# Altium schematic sheet clock.SchDoc
size A4
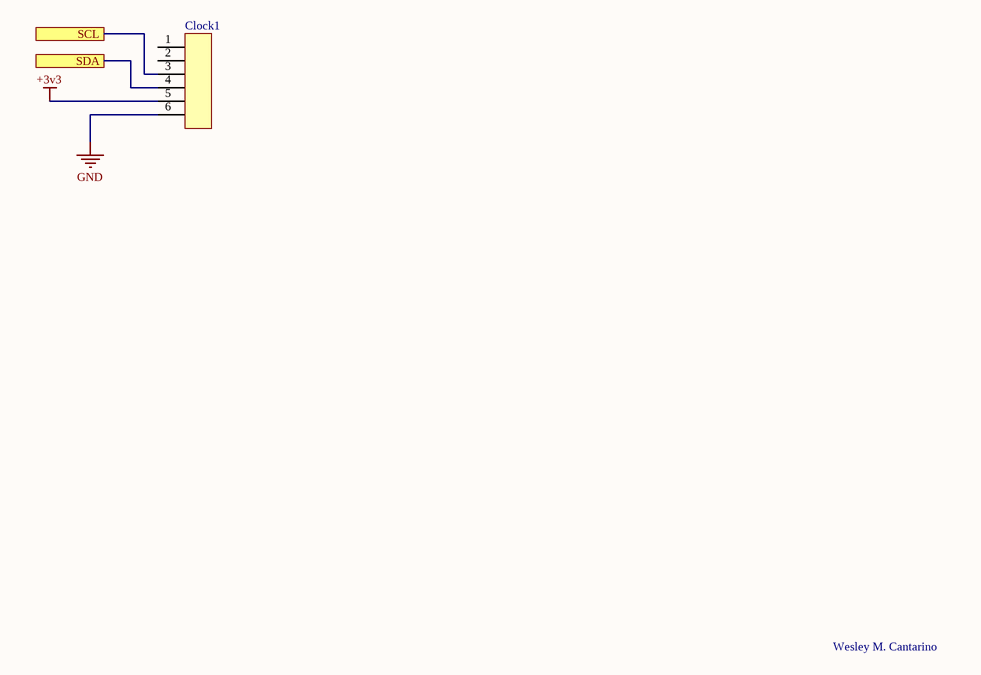
[diagram p0: clock.SchDoc]

## Parts
Clock1  HEADER_1X6  [HEADER_1X6]  (value not drawn)

## Ports
SCL, SDA

## Nets
+3v3: Clock1.5
GND: Clock1.6
SCL: Clock1.3 ; port SCL
SDA: Clock1.4 ; port SDA

Not connected (* = marked no-connect by the designer): Clock1 1 2

## Notes on the sheet
- Wesley M. Cantarino

## Library data of the parts
Clock1 = HEADER_1X6: 1X6; Value: ?